# Altium schematic sheet 37.SchDoc (part 2 of 2)
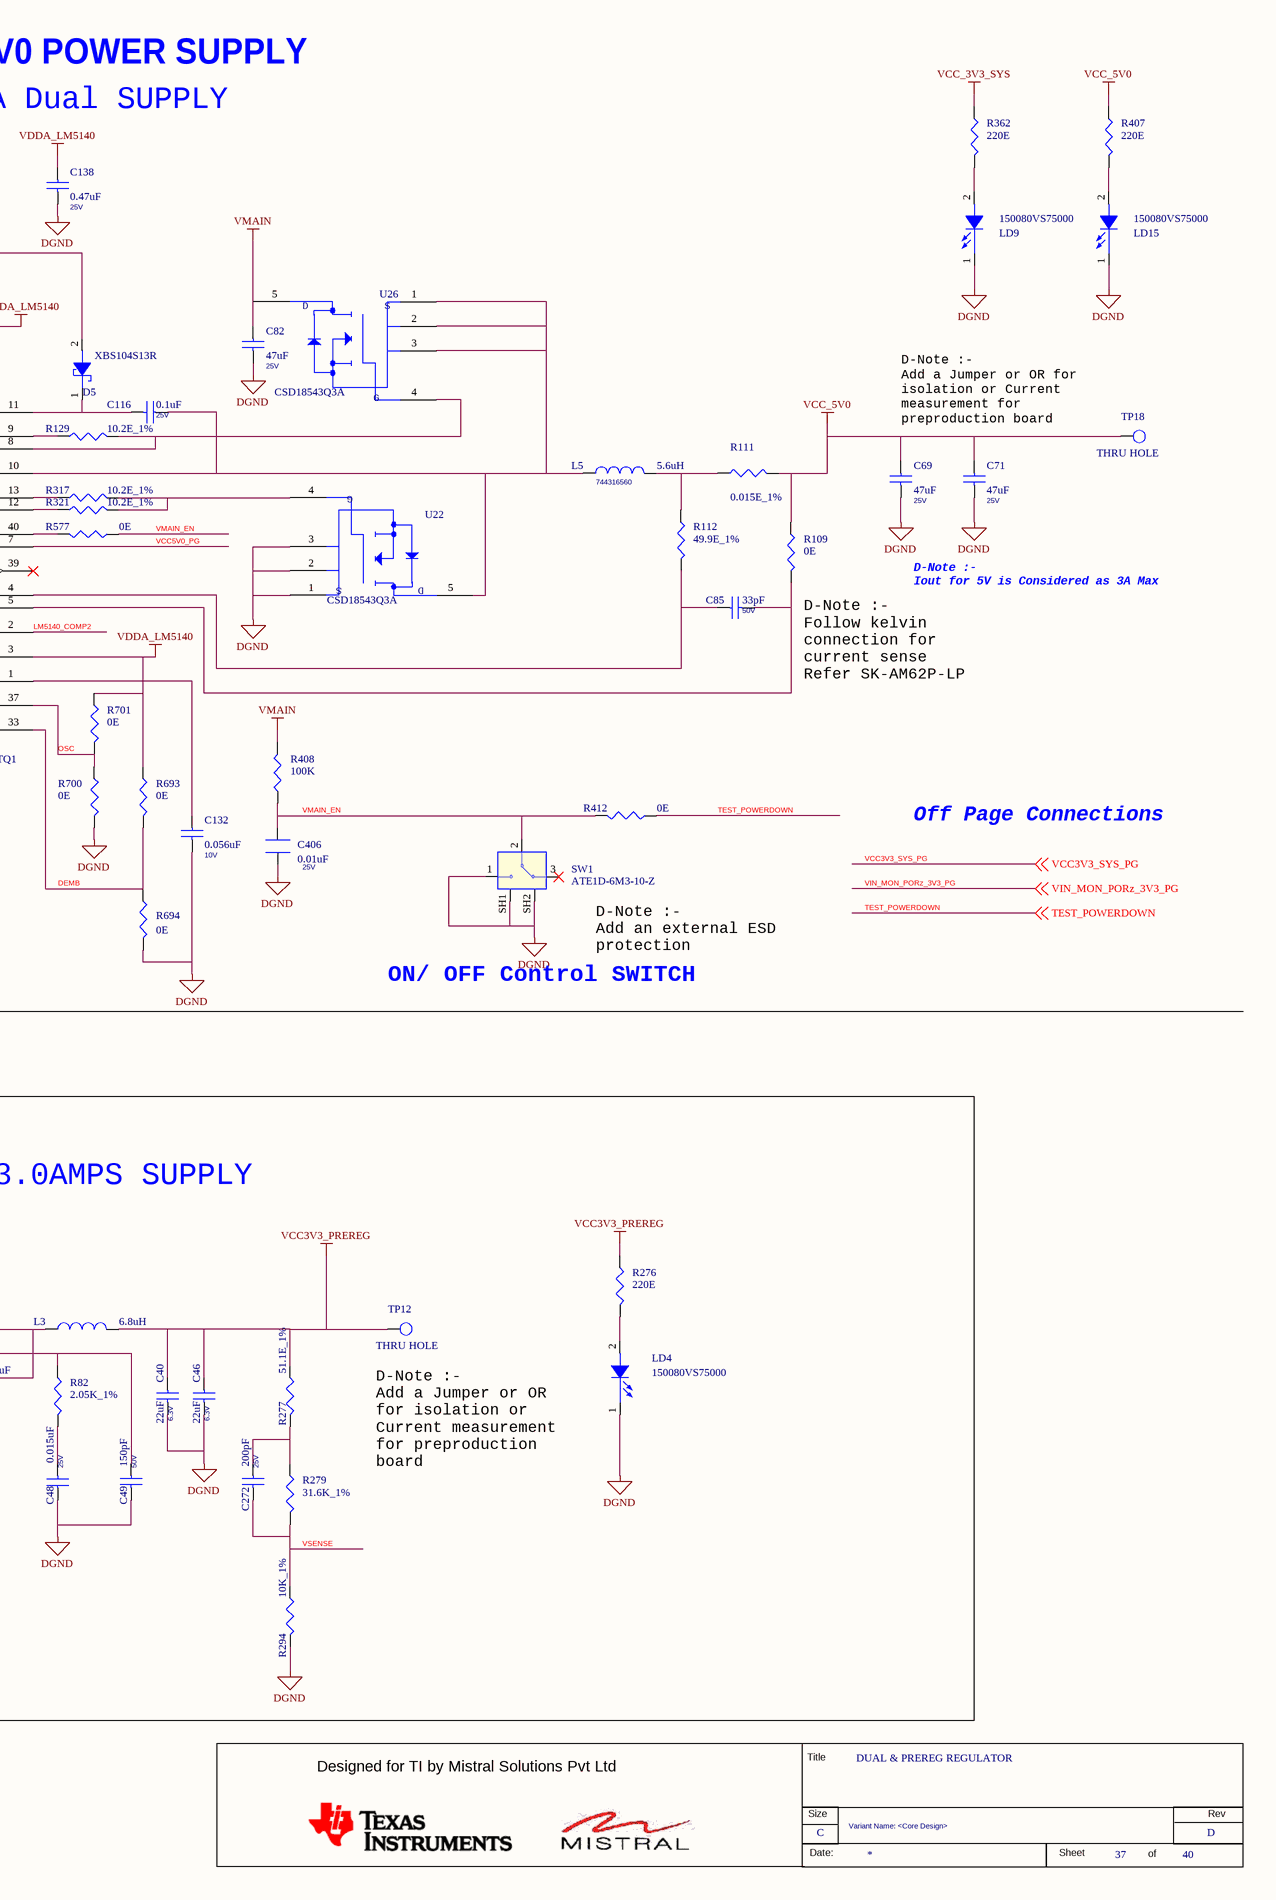
[diagram p2: 37.SchDoc, right]

## Library data of the parts
* = MISTRAL_TITLEBLK_CSIZE: Issue: 1.0; Page Create Date: March  8, 1995; Page Modify Date: *
C40 = CAP_Dup3: CAP CERAMIC 22uF 6.3V 20% X5R 0603; Mistral Part No: 120015090007-R; Mfr_name: MURATA; Mfr_part_number: GRM188R60J226MEA0; Part_type: CAPACITORS\CERAMIC; Project: OCTBTS_3000; Wattage: NA; Customs_HS_Code: 85322990; Custom_Duty: 15%; PCB Footprint: CAP0603_1; Footprint Path: Y:\MIS_DATABASE\Library\ALTIUM_TOOL\PCB_FOOTPRINTS\Altium_Footprint_Lib.PcbLib; Library Path: Y:\MIS_DATABASE\Library\ALTIUM_TOOL\SCHEMATICS_PARTS\MS_DISCRETE_Library.schlib; MECHANICAL 3D STEP FILE: CAP0603_1; Footprint Ref: CAP0603_1; Library Ref: CAP; Tolerance: 20%; Package: 0603; Distributor_name: DIGIKEY; Distributor_part_number: 490-7611-2-ND; Height: 1.00MM; Weight: 6.3mg; Temperature: -55癈+85癈; Datasheet: Y:\MIS_DATABASE\DATASHEETS\CAPACITORS\MURATA-GXX-SER_NOV17.PDF; Crtd /date: JEBRAN/090915; Chkd/date: JEBRAN/090915
C46 = CAP_Dup3: CAP CERAMIC 22uF 6.3V 20% X5R 0603; Part_type: CAPACITORS\CERAMIC; Mfr_part_number: GRM188R60J226MEA0; Mfr_name: MURATA; Mistral Part No: 120015090007-R; Custom_Duty: 15%; Customs_HS_Code: 85322990; Wattage: NA; Project: OCTBTS_3000; PCB Footprint: CAP0603_1; Chkd/date: JEBRAN/090915; Crtd /date: JEBRAN/090915; Datasheet: Y:\MIS_DATABASE\DATASHEETS\CAPACITORS\MURATA-GXX-SER_NOV17.PDF; Temperature: -55癈+85癈; Weight: 6.3mg; Height: 1.00MM; Distributor_part_number: 490-7611-2-ND; Distributor_name: DIGIKEY; Package: 0603; Tolerance: 20%; Library Ref: CAP; Footprint Ref: CAP0603_1; MECHANICAL 3D STEP FILE: CAP0603_1; Library Path: Y:\MIS_DATABASE\Library\ALTIUM_TOOL\SCHEMATICS_PARTS\MS_DISCRETE_Library.schlib; Footprint Path: Y:\MIS_DATABASE\Library\ALTIUM_TOOL\PCB_FOOTPRINTS\Altium_Footprint_Lib.PcbLib
C48 = CAP_Dup3: CAP CERAMIC 0.015uF 25V 10% X7R 0402; Mistral Part No: 120020080005-R; Mfr_name: WURTH ELECTRONICS; Mfr_part_number: 885012205051; Part_type: CAPACITORS\CERAMIC; Project: AM64x_EVM_BRD; Wattage: NA; Customs_HS_Code: 85322990; Custom_Duty: 15%; PCB Footprint: CAP0402_0-75; Library Ref: CAP; Tolerance: 10%; Package: 0402; Distributor_name: DIGIKEY; Distributor_part_number: 732-7546-1-ND; Height: 0.55MM; Weight: 0.65mg; Temperature: -55癈+125癈; Datasheet: Y:\MIS_DATABASE\DATASHEETS\CAPACITORS\885012205051.PDF; Crtd /date: ALVY/170820; Chkd/date: MANIRAJA/170820; Footprint Ref: CAP0402_0-75; MECHANICAL 3D STEP FILE: CAP0402_0-75; Library Path: Y:\MIS_DATABASE\Library\ALTIUM_TOOL\SCHEMATICS_PARTS\MS_DISCRETE_Library.schlib; Footprint Path: Y:\MIS_DATABASE\Library\ALTIUM_TOOL\PCB_FOOTPRINTS\Altium_Footprint_Lib.PcbLib
C49 = CAP_Dup3: CAP CERAMIC 150pF 50V 10% X7R 0402; Mistral Part No: 120018010022-R; Mfr_name: WURTH ELECTRONICS; Mfr_part_number: 885012205056; Part_type: CAPACITORS\CERAMIC; Project: TI_MAXIE_CPB; Wattage: NA; Customs_HS_Code: 85322990; Custom_Duty: 15%; PCB Footprint: CAP0402_0-75; Library Ref: CAP; Tolerance: 10%; Package: 0402; Distributor_name: DIGIKEY; Distributor_part_number: 732-7551-1-ND; Height: 0.55MM; Weight: 0.65mg; Temperature: -55癈+125癈; Datasheet: Y:\MIS_DATABASE\DATASHEETS\CAPACITORS\885012205056.PDF; Crtd /date: MANIRAJA/240118; Chkd/date: MANIRAJA/240118; MECHANICAL 3D STEP FILE: CAP0402_0-75; Footprint Ref: CAP0402_0-75; Library Path: Y:\MIS_DATABASE\Library\ALTIUM_TOOL\SCHEMATICS_PARTS\MS_DISCRETE_Library.schlib; Footprint Path: Y:\MIS_DATABASE\Library\ALTIUM_TOOL\PCB_FOOTPRINTS\Altium_Footprint_Lib.PcbLib
C54 C65 C115 = CAP_Dup3: CAP CERAMIC 0.1uF 25V 20% X5R 0402; Alt_Mfr_part_number: CC0402KRX5R8BB104; Mistral Part No: 120020080003-R; Mfr_name: WURTH ELECTRONICS; Mfr_part_number: 885012105018; Part_type: CAPACITORS\CERAMIC; Alt_Mfr_name: YAGEO AMERICA; Project: AM64x_EVM_BRD; Wattage: NA; Customs_HS_Code: 85322990; Custom_Duty: 15%; PCB Footprint: CAP0402_0-75; Tolerance: 20%; Package: 0402; Distributor_name: DIGIKEY; Distributor_part_number: 732-7495-1-ND; Height: 0.55MM; Weight: 0.65mg; Temperature: -55癈+85癈; Datasheet: Y:\MIS_DATABASE\DATASHEETS\CAPACITORS\885012105018.PDF; Crtd /date: ALVY/170820; Chkd/date: MANIRAJA/170820; MECHANICAL 3D STEP FILE: CAP0402_0-75; Library Ref: CAP; Footprint Ref: CAP0402_0-75; Library Path: Y:\MIS_DATABASE\Library\ALTIUM_TOOL\SCHEMATICS_PARTS\MS_DISCRETE_Library.schlib; Footprint Path: Y:\MIS_DATABASE\Library\ALTIUM_TOOL\PCB_FOOTPRINTS\Altium_Footprint_Lib.PcbLib
C66 = CAP_Dup3: CAP CERAMIC 10uF 35V 20% X5R 0603; Part_type: CAPACITORS\CERAMIC; Mfr_part_number: GRM188R6YA106MA73D; Mfr_name: MURATA; Mistral Part No: 120019050016-R; Custom_Duty: 15%; Customs_HS_Code: 85322990; Wattage: NA; Project: BRUKER_SD820_COMMONDO; PCB Footprint: CAP0603_1; Footprint Path: Y:\MIS_DATABASE\Library\ALTIUM_TOOL\PCB_FOOTPRINTS\Altium_Footprint_Lib.PcbLib; Library Path: Y:\MIS_DATABASE\Library\ALTIUM_TOOL\SCHEMATICS_PARTS\MS_DISCRETE_Library.schlib; Footprint Ref: CAP0603_1; Library Ref: CAP; MECHANICAL 3D STEP FILE: CAP0603_1; Chkd/date: MANIRAJA/170519; Crtd /date: ALVY/160519; Datasheet: Y:\MIS_DATABASE\DATASHEETS\CAPACITORS\GRM188R6YA106MA73.PDF; Temperature: -55癈+85癈; Weight: 9mg; Height: 1.00MM; Distributor_part_number: 490-13248-1-ND; Distributor_name: DIGIKEY; Package: 0603; Tolerance: 20%
C69 C81 C82 = CAP: CAP CERAMIC 47uF 25V 20% X5R 1206; Mistral Part No: 120013050002-R; Mfr_name: MURATA; Mfr_part_number: GRM31CR61E476ME44L; Part_type: CAPACITORS\CERAMIC; Project: TI_MAXIE_CPB; Wattage: NA; Customs_HS_Code: 85322990; Custom_Duty: 15%; PCB Footprint: CAP1206_2; Footprint Ref: CAP1206_2; Tolerance: 20%; Package: 1206; Distributor_name: DIGIKEY; Distributor_part_number: 490-16268-1-ND; Library Ref: CAP; Height: 1.80MM; Weight: 40mg; Temperature: -55癈+85癈; Datasheet: Y:\MIS_DATABASE\DATASHEETS\CAPACITORS\MURATA-GXX-SER_NOV17.PDF; Crtd /date: MANIRAJA/230118; Chkd/date: MANIRAJA/230118; MECHANICAL 3D STEP FILE: CAP1206_2; Library Path: Y:\MIS_DATABASE\Library\ALTIUM_TOOL\SCHEMATICS_PARTS\MS_DISCRETE_Library.schlib; Footprint Path: Y:\MIS_DATABASE\Library\ALTIUM_TOOL\PCB_FOOTPRINTS\Altium_Footprint_Lib.PcbLib
C70 = CAP_POL: CAP POLYMER 470uF 10V 20% SMD; Mistral Part No: 120020080001-R; Mfr_name: WURTH ELECTRONICS; Mfr_part_number: 875115252003; Part_type: CAPACITORS\POLYPROPYLENE; Project: AM64x_EVM_BRD; Wattage: NA; Customs_HS_Code: 85322990; Custom_Duty: 15%; Footprint Ref: CAPAE_875115252003_330X330_SMD_8-7; Tolerance: 20%; Voltage: 10V; Package: SMD; Distributor_name: DIGIKEY; Distributor_part_number: 732-6451-1-ND; Library Ref: CAP_POL; Height: 8.70MM; Weight: 640.2mg; Temperature: -55癈+105癈; Datasheet: Y:\MIS_DATABASE\DATASHEETS\CAPACITORS\875115252003.PDF; Crtd /date: ALVY/140820; Chkd/date: MANIRAJA/140820; MECHANICAL 3D STEP FILE: CAPAE_875115252003_330X330_SMD_8-7; Library Path: Y:\MIS_DATABASE\Library\ALTIUM_TOOL\SCHEMATICS_PARTS\MS_DISCRETE_Library.schlib; Footprint Path: Y:\MIS_DATABASE\Library\ALTIUM_TOOL\PCB_FOOTPRINTS\Altium_Footprint_Lib.PcbLib; PCB Footprint: CAPAE_875115252003_330X330_SMD_8-7
C71 = CAP_Dup3: CAP CERAMIC 47uF 25V 20% X5R 1206; Part_type: CAPACITORS\CERAMIC; Mfr_part_number: GRM31CR61E476ME44L; Mfr_name: MURATA; Mistral Part No: 120013050002-R; Custom_Duty: 15%; Customs_HS_Code: 85322990; Wattage: NA; Project: TI_MAXIE_CPB; PCB Footprint: CAP1206_2; Footprint Path: Y:\MIS_DATABASE\Library\ALTIUM_TOOL\PCB_FOOTPRINTS\Altium_Footprint_Lib.PcbLib; Library Path: Y:\MIS_DATABASE\Library\ALTIUM_TOOL\SCHEMATICS_PARTS\MS_DISCRETE_Library.schlib; Footprint Ref: CAP1206_2; Library Ref: CAP; MECHANICAL 3D STEP FILE: CAP1206_2; Chkd/date: MANIRAJA/230118; Crtd /date: MANIRAJA/230118; Datasheet: Y:\MIS_DATABASE\DATASHEETS\CAPACITORS\MURATA-GXX-SER_NOV17.PDF; Temperature: -55癈+85癈; Weight: 40mg; Height: 1.80MM; Distributor_part_number: 490-16268-1-ND; Distributor_name: DIGIKEY; Package: 1206; Tolerance: 20%
C84 = CAP_Dup3: CAP CERAMIC 22uF 25V 20% X6S 1206; Part_type: CAPACITORS\CERAMIC; Mfr_part_number: GRM31CC81E226ME11K; Mfr_name: MURATA; Mistral Part No: 120022050004-R; Custom_Duty: 15%; Customs_HS_Code: 85322990; Wattage: NA; Project: TI_AM62x_SKEVM_BRD; PCB Footprint: CAP1206_2; Library Ref: CAP; MECHANICAL 3D STEP FILE: CAP1206_2; Chkd/date: ALVY/160522; Crtd /date: ALVY/160522; Datasheet: Y:\MIS_DATABASE\DATASHEETS\CAPACITORS\GRM31CC81E226ME11.PDF; Temperature: -55癈+105癈; Weight: 27mg; Height: 1.90MM; Distributor_part_number: 81-GRM31CC81E226ME1K; Distributor_name: MOUSER; Package: 1206; Tolerance: 20%; Footprint Ref: CAP1206_2; Library Path: Y:\MIS_DATABASE\Library\ALTIUM_TOOL\SCHEMATICS_PARTS\MS_DISCRETE_Library.schlib; Footprint Path: Y:\MIS_DATABASE\Library\ALTIUM_TOOL\PCB_FOOTPRINTS\Altium_Footprint_Lib.PcbLib
C85 = CAP: CAP CERAMIC 33pF 50V 5% C0G(NP0) 0402; Part_type: CAPACITORS\CERAMIC; Mfr_part_number: 885012005058; Mfr_name: WURTH ELECTRONICS; Mistral Part No: 120009030395-R; Custom_Duty: 15%; Customs_HS_Code: 85322990; Wattage: NA; Project: AM64x_EVM_BRD; PCB Footprint: CAP0402_0-75; Footprint Path: Y:\MIS_DATABASE\Library\ALTIUM_TOOL\PCB_FOOTPRINTS\Altium_Footprint_Lib.PcbLib; Library Path: Y:\MIS_DATABASE\Library\ALTIUM_TOOL\SCHEMATICS_PARTS\MS_DISCRETE_Library.schlib; MECHANICAL 3D STEP FILE: CAP0402_0-75; Chkd/date: MANIRAJA/170820; Crtd /date: ALVY/170820; Datasheet: Y:\MIS_DATABASE\DATASHEETS\CAPACITORS\885012005058.PDF; Temperature: -55癈+125癈; Weight: 0.65mg; Height: 0.55MM; Library Ref: CAP; Distributor_part_number: 732-7472-1-ND; Distributor_name: DIGIKEY; Package: 0402; Tolerance: 5%; Footprint Ref: CAP0402_0-75
C94 C135 = CAP: CAP CERAMIC 33pF 50V 5% C0G(NP0) 0402; Mistral Part No: 120009030395-R; Mfr_name: WURTH ELECTRONICS; Mfr_part_number: 885012005058; Part_type: CAPACITORS\CERAMIC; Project: AM64x_EVM_BRD; Wattage: NA; Customs_HS_Code: 85322990; Custom_Duty: 15%; Footprint Ref: CAP0402_0-75; Tolerance: 5%; Package: 0402; Distributor_name: DIGIKEY; Distributor_part_number: 732-7472-1-ND; Library Ref: CAP; Height: 0.55MM; Weight: 0.65mg; Temperature: -55癈+125癈; Datasheet: Y:\MIS_DATABASE\DATASHEETS\CAPACITORS\885012005058.PDF; Crtd /date: ALVY/170820; Chkd/date: MANIRAJA/170820; MECHANICAL 3D STEP FILE: CAP0402_0-75; Library Path: Y:\MIS_DATABASE\Library\ALTIUM_TOOL\SCHEMATICS_PARTS\MS_DISCRETE_Library.schlib; Footprint Path: Y:\MIS_DATABASE\Library\ALTIUM_TOOL\PCB_FOOTPRINTS\Altium_Footprint_Lib.PcbLib; PCB Footprint: CAP0402_0-75
C107 = CAP: CAP CERAMIC 2.2uF 35V 10% X5R 0603; Mistral Part No: 120017010016-R; Mfr_name: MURATA; Mfr_part_number: GRM188R6YA225KA12D; Part_type: CAPACITORS\CERAMIC; Project: SD820_NANO_SOM; Wattage: NA; Customs_HS_Code: 85322990; Custom_Duty: 15%; PCB Footprint: CAP0603_1; Footprint Ref: CAP0603_1; Tolerance: 10%; Package: 0603; Distributor_name: DIGIKEY; Distributor_part_number: 490-7204-1-ND; Library Ref: CAP; Height: 0.90MM; Weight: 6.3mg; Temperature: -55癈+85癈; Datasheet: Y:\MIS_DATABASE\DATASHEETS\CAPACITORS\MURATA-GXX-SER_NOV17.PDF; Crtd /date: MANIRAJA/270117; Chkd/date: VASANTHA/270117; MECHANICAL 3D STEP FILE: CAP0603_1; Library Path: Y:\MIS_DATABASE\Library\ALTIUM_TOOL\SCHEMATICS_PARTS\MS_DISCRETE_Library.schlib; Footprint Path: Y:\MIS_DATABASE\Library\ALTIUM_TOOL\PCB_FOOTPRINTS\Altium_Footprint_Lib.PcbLib
C108 C539 = CAP: CAP CERAMIC 2.2uF 35V 10% X5R 0603; Part_type: CAPACITORS\CERAMIC; Mfr_part_number: GRM188R6YA225KA12D; Mfr_name: MURATA; Mistral Part No: 120017010016-R; Custom_Duty: 15%; Customs_HS_Code: 85322990; Wattage: NA; Project: SD820_NANO_SOM; PCB Footprint: CAP0603_1; Footprint Path: Y:\MIS_DATABASE\Library\ALTIUM_TOOL\PCB_FOOTPRINTS\Altium_Footprint_Lib.PcbLib; Library Path: Y:\MIS_DATABASE\Library\ALTIUM_TOOL\SCHEMATICS_PARTS\MS_DISCRETE_Library.schlib; MECHANICAL 3D STEP FILE: CAP0603_1; Chkd/date: VASANTHA/270117; Crtd /date: MANIRAJA/270117; Datasheet: Y:\MIS_DATABASE\DATASHEETS\CAPACITORS\MURATA-GXX-SER_NOV17.PDF; Temperature: -55癈+85癈; Weight: 6.3mg; Height: 0.90MM; Library Ref: CAP; Distributor_part_number: 490-7204-1-ND; Distributor_name: DIGIKEY; Package: 0603; Tolerance: 10%; Footprint Ref: CAP0603_1
C116 C494 = CAP_Dup3: CAP CERAMIC 0.1uF 25V 20% X5R 0402; Alt_Mfr_name: YAGEO AMERICA; Part_type: CAPACITORS\CERAMIC; Mfr_part_number: 885012105018; Mfr_name: WURTH ELECTRONICS; Mistral Part No: 120020080003-R; Alt_Mfr_part_number: CC0402KRX5R8BB104; Custom_Duty: 15%; Customs_HS_Code: 85322990; Wattage: NA; Project: AM64x_EVM_BRD; PCB Footprint: CAP0402_0-75; Footprint Path: Y:\MIS_DATABASE\Library\ALTIUM_TOOL\PCB_FOOTPRINTS\Altium_Footprint_Lib.PcbLib; Library Path: Y:\MIS_DATABASE\Library\ALTIUM_TOOL\SCHEMATICS_PARTS\MS_DISCRETE_Library.schlib; Footprint Ref: CAP0402_0-75; Library Ref: CAP; MECHANICAL 3D STEP FILE: CAP0402_0-75; Chkd/date: MANIRAJA/170820; Crtd /date: ALVY/170820; Datasheet: Y:\MIS_DATABASE\DATASHEETS\CAPACITORS\885012105018.PDF; Temperature: -55癈+85癈; Weight: 0.65mg; Height: 0.55MM; Distributor_part_number: 732-7495-1-ND; Distributor_name: DIGIKEY; Package: 0402; Tolerance: 20%
C118 C136 = CAP_Dup2: CAP CERAMIC 0.01uF 25V 10% X7R 0402; Part_type: CAPACITORS\CERAMIC; Mfr_part_number: 885012205050; Mfr_name: WURTH ELECTRONICS; Mistral Part No: 120011090040-R; PCB Footprint: CAP0402_0-75; Wattage: NA; Custom_Duty: 15%; Customs_HS_Code: 85322990; Project: AM64x_EVM_BRD; Footprint Path: Y:\MIS_DATABASE\Library\ALTIUM_TOOL\PCB_FOOTPRINTS\Altium_Footprint_Lib.PcbLib; Library Path: Y:\MIS_DATABASE\Library\ALTIUM_TOOL\SCHEMATICS_PARTS\MS_DISCRETE_Library.schlib; Footprint Ref: CAP0402_0-75; MECHANICAL 3D STEP FILE: CAP0402_0-75; Temperature: -55癈+125癈; Weight: 0.65mg; Chkd/date: MANIRAJA/170820; Crtd /date: ALVY/170820; Datasheet: Y:\MIS_DATABASE\DATASHEETS\CAPACITORS\885012205050.PDF; Height: 0.55MM; Distributor_part_number: 732-7545-1-ND; Distributor_name: DIGIKEY; Package: 0402; Tolerance: 10%; Library Ref: CAP
C123 = CAP: CAP CERAMIC 47uF 25V 20% X5R 1206; Part_type: CAPACITORS\CERAMIC; Mfr_part_number: GRM31CR61E476ME44L; Mfr_name: MURATA; Mistral Part No: 120013050002-R; Custom_Duty: 15%; Customs_HS_Code: 85322990; Wattage: NA; Project: TI_MAXIE_CPB; PCB Footprint: CAP1206_2; Footprint Path: Y:\MIS_DATABASE\Library\ALTIUM_TOOL\PCB_FOOTPRINTS\Altium_Footprint_Lib.PcbLib; Library Path: Y:\MIS_DATABASE\Library\ALTIUM_TOOL\SCHEMATICS_PARTS\MS_DISCRETE_Library.schlib; MECHANICAL 3D STEP FILE: CAP1206_2; Chkd/date: MANIRAJA/230118; Crtd /date: MANIRAJA/230118; Datasheet: Y:\MIS_DATABASE\DATASHEETS\CAPACITORS\MURATA-GXX-SER_NOV17.PDF; Temperature: -55癈+85癈; Weight: 40mg; Height: 1.80MM; Library Ref: CAP; Distributor_part_number: 490-16268-1-ND; Distributor_name: DIGIKEY; Package: 1206; Tolerance: 20%; Footprint Ref: CAP1206_2
C125 = CAP_Dup3: CAP CERAMIC 3900pF 25V 10% X7R 0402; Mistral Part No: 120015120019-R; Mfr_name: YAGEO AMERICA; Mfr_part_number: CC0402KRX7R8BB392; Part_type: CAPACITORS\CERAMIC; Project: DLRL_NBSDR; Wattage: NA; Customs_HS_Code: 85322990; Custom_Duty: 15%; PCB Footprint: CAP0402_0-75; Footprint Ref: CAP0402_0-75; Tolerance: 10%; Package: 0402; Distributor_name: DIGIKEY; Distributor_part_number: 311-1038-1-ND; Library Ref: CAP; Height: 0.55MM; Weight: 0.65mg; Temperature: -55癈+125癈; Datasheet: Y:\MIS_DATABASE\DATASHEETS\CAPACITORS\YACC-X7R.PDF; Crtd /date: VASANTHA/211215; Chkd/date: VASANTHA/211215; MECHANICAL 3D STEP FILE: CAP0402_0-75; Library Path: Y:\MIS_DATABASE\Library\ALTIUM_TOOL\SCHEMATICS_PARTS\MS_DISCRETE_Library.schlib; Footprint Path: Y:\MIS_DATABASE\Library\ALTIUM_TOOL\PCB_FOOTPRINTS\Altium_Footprint_Lib.PcbLib
C130 = CAP_Dup2: CAP CERAMIC 4.7pF 50V 0.25pF HI-Q C0G(NP0) 0402; Mistral Part No: 120013040025-R; Mfr_name: MURATA; Mfr_part_number: GJM1555C1H4R7CB01D; Part_type: CAPACITORS\CERAMIC; PCB Footprint: CAP0402_0-75; Project: DTRM; Tolerance: 0.25pF%; Customs_HS_Code: 85322990; Custom_Duty: 15%; Wattage: NA; Library Ref: CAP; Package: 0402; Distributor_name: DIGIKEY; Distributor_part_number: 490-3100-1-ND; Height: 0.55MM; Datasheet: Y:\MIS_DATABASE\DATASHEETS\CAPACITORS\MURATA-GXX-SER_NOV17.PDF; Crtd /date: USMAN/290413; Chkd/date: VASANTHA/220814; Weight: 6mg; Temperature: -55癈+125癈; MECHANICAL 3D STEP FILE: CAP0402_0-75; Footprint Ref: CAP0402_0-75; Library Path: Y:\MIS_DATABASE\Library\ALTIUM_TOOL\SCHEMATICS_PARTS\MS_DISCRETE_Library.schlib; Footprint Path: Y:\MIS_DATABASE\Library\ALTIUM_TOOL\PCB_FOOTPRINTS\Altium_Footprint_Lib.PcbLib
C131 C132 = CAP_Dup3: CAP CERAMIC 0.056uF 10V 10% X7R 0402; Part_type: CAPACITORS\CERAMIC; Mfr_part_number: C0402C563K8RACTU; Mfr_name: KEMET; Mistral Part No: 120011110014-R; Custom_Duty: 15%; Customs_HS_Code: 85322990; Wattage: NA; Project: AVCDP1; PCB Footprint: CAP0402_0-75; MECHANICAL 3D STEP FILE: CAP0402_0-75; Chkd/date: USMAN/161111; Crtd /date: CHAITHANYA/151111; Datasheet: Y:\MIS_DATABASE\DATASHEETS\CAPACITORS\KEMET-C-X7R.PDF; Temperature: -55癈+125癈; Weight: 0.65mg; Height: 0.55MM; Distributor_part_number: 399-4902-1-ND; Distributor_name: DIGIKEY; Package: 0402; Tolerance: 10%; Library Ref: CAP; Footprint Ref: CAP0402_0-75; Library Path: Y:\MIS_DATABASE\Library\ALTIUM_TOOL\SCHEMATICS_PARTS\MS_DISCRETE_Library.schlib; Footprint Path: Y:\MIS_DATABASE\Library\ALTIUM_TOOL\PCB_FOOTPRINTS\Altium_Footprint_Lib.PcbLib
C137 = CAP_Dup3: CAP CERAMIC 1uF 10V 20% X5R 0402; Part_type: CAPACITORS\CERAMIC; Mfr_part_number: 885012105012; Mfr_name: WURTH ELECTRONICS; Mistral Part No: 120020080009-R; Custom_Duty: 15%; Customs_HS_Code: 85322990; Wattage: NA; Project: AM64x_EVM_BRD; PCB Footprint: CAP0402_0-75; Footprint Ref: CAP0402_0-75; Library Ref: CAP; Footprint Path: Y:\MIS_DATABASE\Library\ALTIUM_TOOL\PCB_FOOTPRINTS\Altium_Footprint_Lib.PcbLib; Library Path: Y:\MIS_DATABASE\Library\ALTIUM_TOOL\SCHEMATICS_PARTS\MS_DISCRETE_Library.schlib; MECHANICAL 3D STEP FILE: CAP0402_0-75; Chkd/date: MANIRAJA/210820; Crtd /date: ALVY/190820; Datasheet: Y:\MIS_DATABASE\DATASHEETS\CAPACITORS\885012105012.PDF; Temperature: -55癈+85癈; Weight: 0.65mg; Height: 0.55MM; Distributor_part_number: 732-7489-1-ND; Distributor_name: DIGIKEY; Package: 0402; Tolerance: 20%
C138 = CAP: CAP CERAMIC 0.47uF 25V 10% X7R 0603; Mistral Part No: 120009030111-R; Mfr_name: WURTH ELECTRONICS; Mfr_part_number: 885012206075; Part_type: CAPACITORS\CERAMIC; Project: AM64x_EVM_BRD; Wattage: NA; Customs_HS_Code: 85322990; Custom_Duty: 15%; PCB Footprint: CAP0603_1; Footprint Ref: CAP0603_1; Tolerance: 10%; Package: 0603; Distributor_name: DIGIKEY; Distributor_part_number: 732-7993-1-ND; Library Ref: CAP; Height: 0.95MM; Weight: 35mg; Temperature: -55癈+125癈; Datasheet: Y:\MIS_DATABASE\DATASHEETS\CAPACITORS\885012206075.PDF; Crtd /date: ALVY/170820; Chkd/date: MANIRAJA/170820; MECHANICAL 3D STEP FILE: CAP0603_1; Library Path: Y:\MIS_DATABASE\Library\ALTIUM_TOOL\SCHEMATICS_PARTS\MS_DISCRETE_Library.schlib; Footprint Path: Y:\MIS_DATABASE\Library\ALTIUM_TOOL\PCB_FOOTPRINTS\Altium_Footprint_Lib.PcbLib
C272 = CAP_Dup3: CAP CERAMIC 200pF 25V 5% C0G(NP0) 0402; Part_type: CAPACITORS\CERAMIC; Mfr_part_number: GRM1555C1E201JA01D; Mfr_name: MURATA; Mistral Part No: 120022050005-R; Custom_Duty: 15%; Customs_HS_Code: 85322990; Wattage: NA; Project: TI_AM62x_SKEVM_BRD; PCB Footprint: CAP0402_0-75; Library Ref: CAP; MECHANICAL 3D STEP FILE: CAP0402_0-75; Chkd/date: ALVY/160522; Crtd /date: ALVY/160522; Datasheet: Y:\MIS_DATABASE\DATASHEETS\CAPACITORS\GRM1555C1E201JA01.PDF; Temperature: -55癈+125癈; Weight: 1.5mg; Height: 0.55MM; Distributor_part_number: GRM1555C1E201JA01D-ND; Distributor_name: DIGIKEY; Package: 0402; Tolerance: 5%; Footprint Ref: CAP0402_0-75; Library Path: Y:\MIS_DATABASE\Library\ALTIUM_TOOL\SCHEMATICS_PARTS\MS_DISCRETE_Library.schlib; Footprint Path: Y:\MIS_DATABASE\Library\ALTIUM_TOOL\PCB_FOOTPRINTS\Altium_Footprint_Lib.PcbLib
C406 = CAP_Dup2: CAP CERAMIC 0.01uF 25V 10% X7R 0402; Mistral Part No: 120011090040-R; Mfr_name: WURTH ELECTRONICS; Mfr_part_number: 885012205050; Part_type: CAPACITORS\CERAMIC; PCB Footprint: CAP0402_0-75; Project: AM64x_EVM_BRD; Customs_HS_Code: 85322990; Custom_Duty: 15%; Wattage: NA; Library Ref: CAP; Tolerance: 10%; Package: 0402; Distributor_name: DIGIKEY; Distributor_part_number: 732-7545-1-ND; Height: 0.55MM; Datasheet: Y:\MIS_DATABASE\DATASHEETS\CAPACITORS\885012205050.PDF; Crtd /date: ALVY/170820; Chkd/date: MANIRAJA/170820; Weight: 0.65mg; Temperature: -55癈+125癈; MECHANICAL 3D STEP FILE: CAP0402_0-75; Footprint Ref: CAP0402_0-75; Library Path: Y:\MIS_DATABASE\Library\ALTIUM_TOOL\SCHEMATICS_PARTS\MS_DISCRETE_Library.schlib; Footprint Path: Y:\MIS_DATABASE\Library\ALTIUM_TOOL\PCB_FOOTPRINTS\Altium_Footprint_Lib.PcbLib
D4 D5 = DIODE_SCHOTTKY: DIODE SCHOTTKY 40V 1A SOD323A; Part_type: DIODE\SCHOTTKY; Mfr_part_number: XBS104S13R-G; Mfr_name: TOREX; Mistral Part No: 130018020038-R; Custom_Duty: 24%; Customs_HS_Code: 85437099; Wattage: NA; Project: TI_MAXIE_CPB; MECHANICAL 3D STEP FILE: DIO_SOD323_1; Chkd/date: MANIRAJA/150218; Crtd /date: ALVY/150218; Datasheet: Y:\MIS_DATABASE\DATASHEETS\DISCRETES\DIODES\XBS104S13R-G.PDF; Temperature: NA; Weight: NA; Height: 1.00MM; Distributor_part_number: 893-1188-1-ND; Distributor_name: DIGIKEY; Package: SOD323; Voltage: 40V; Tolerance: NA; Library Path: Y:\MIS_DATABASE\Library\ALTIUM_TOOL\SCHEMATICS_PARTS\MS_DISCRETE_Library.schlib; Footprint Path: Y:\MIS_DATABASE\Library\ALTIUM_TOOL\PCB_FOOTPRINTS\Altium_Footprint_Lib.PcbLib; Library Ref: DIODE_SCHOTTKY; Footprint Ref: DIO_SOD323_1; PCB Footprint: DIO_SOD323_1
L3 = INDUCTOR_Dup1: IND POWER 6.8uH 6.5A 20% SMD; Mfr_part_number: 74439346068; Mfr_name: WURTH ELECTRONICS; Mistral Part No: 130017100019-R; Custom_Duty: 24%; Customs_HS_Code: 85437099; Wattage: NA; Project: TI_MAXIE_CPB; PCB Footprint: IND_74439346068_260X270_SMD_6-1; Library Ref: INDUCTOR; MECHANICAL 3D STEP FILE: IND_74439346068_260X270_SMD_6-1; Chkd/date: MANIRAJA/171017; Crtd /date: MANIRAJA/171017; Datasheet: Y:\MIS_DATABASE\DATASHEETS\DISCRETES\INDUCTORS\74439346068.PDF; Temperature: -40癈+125癈; Weight: NA; Height: 6.10MM; Distributor_part_number: 732-10705-1-ND; Distributor_name: DIGIKEY; Package: SMD; Voltage: NA; Tolerance: 20%; Part_type: INDUCTOR
L5 = INDUCTOR_Dup1: IND HI-CURRENT 5.6uH 4.5A 20% SMD; Mistral Part No: 130023110008-R; Mfr_name: WURTH ELEKTRONIK; Project: AM62x_SK_EVM; Tolerance: 0.2; Voltage: NA; Customs_HS_Code: 85437099; Custom_Duty: 24%; Part_type: INDUCTOR; Wattage: NA; Package: SMD; Distributor_name: DIGIKEY; Distributor_part_number: 732-6183-1-ND; Library Ref: INDUCTOR; Footprint Ref: IND_744316100_230X220_SMD_4-3; Height: 4.30MM; Weight: 570mg; Temperature: -40癈+150癈; Datasheet: Y:\MIS_DATABASE\DATASHEETS\DISCRETES\INDUCTORS\744316560.PDF; Crtd /date: PRADEEP/171123; Chkd/date: PRADEEP/171123; MECHANICAL 3D STEP FILE: IND_744316100_230X220_SMD_4-3; Library Path: Y:\MIS_DATABASE\Library\ALTIUM_TOOL\SCHEMATICS_PARTS\MS_DISCRETE_Library.schlib; Footprint Path: Y:\MIS_DATABASE\Library\ALTIUM_TOOL\PCB_FOOTPRINTS\Altium_Footprint_Lib.PcbLib; PCB Footprint: IND_744316100_230X220_SMD_4-3
L6 = INDUCTOR: IND POWER 1.5uH 8A 20% SMD; Mistral Part No: 130023060041-R; Mfr_name: WURTH ELEKTRONIK; Project: SDI_MODULE; Voltage: NA; Customs_HS_Code: 85437099; Custom_Duty: 0.24; Footprint Ref: IND_74437349012_270X270_SMD_5; Part_type: INDUCTOR; Tolerance: 20%; Wattage: NA; Package: SMD; Distributor_name: DIGIKEY; Distributor_part_number: 732-3351-1-ND; Library Ref: INDUCTOR; Height: 5.00MM; Weight: 1220mg; Temperature: -40癈+125癈; Datasheet: Y:\MIS_DATABASE\DATASHEETS\DISCRETES\INDUCTORS\74437349015.PDF; Crtd /date: PRADEEP/280623; Chkd/date: PRADEEP/280623; MECHANICAL 3D STEP FILE: IND_74437349012_270X270_SMD_5; Library Path: Y:\MIS_DATABASE\Library\ALTIUM_TOOL\SCHEMATICS_PARTS\MS_DISCRETE_Library.schlib; Footprint Path: Y:\MIS_DATABASE\Library\ALTIUM_TOOL\PCB_FOOTPRINTS\Altium_Footprint_Lib.PcbLib; PCB Footprint: IND_74437349012_270X270_SMD_5
LD4 LD9 LD15 = DIODE_LED: DIODE LED BRIGHT GREEN SMD; Part_type: OPTO\LED; Mfr_name: WURTH ELECTRONICS; Mistral Part No: 130020080012-R; Custom_Duty: 24%; Customs_HS_Code: 85439000; Wattage: NA; Project: AM64x_EVM_BRD; Footprint Path: Y:\MIS_DATABASE\Library\ALTIUM_TOOL\PCB_FOOTPRINTS\Altium_Footprint_Lib.PcbLib; Library Path: Y:\MIS_DATABASE\Library\ALTIUM_TOOL\SCHEMATICS_PARTS\MS_OPTO_Library.schlib; MECHANICAL 3D STEP FILE: LED_150080VS75000_80X50_SMD_0-8; Chkd/date: MANIRAJA/180820; Crtd /date: ALVY/180820; Datasheet: Y:\MIS_DATABASE\DATASHEETS\DISCRETES\LEDS\150080VS75000.PDF; Temperature: -40癈+85癈; Weight: 10mg; Height: 0.80MM; Library Ref: DIODE_LED; Distributor_part_number: 732-4986-1-ND; Distributor_name: DIGIKEY; Package: SMD; Voltage: NA; Tolerance: NA; Mfr_part_number: 150080VS75000; Footprint Ref: LED_150080VS75000_80X50_SMD_0-8; PCB Footprint: LED_150080VS75000_80X50_SMD_0-8
R82 = RESISTOR_Dup6: RES 2.05K 1/10W 1% 0402; Part_type: RESISTORS\FIXED; Mfr_part_number: ERJ-2RKF2051X; Mfr_name: PANASONIC-ECG; Mistral Part No: 110014110019-R; Custom_Duty: 15%; Customs_HS_Code: 85332119; Voltage: NA; Project: ZK BIOMETRIC; Library Ref: RESISTOR; Chkd/date: NAVEED/261214; Crtd /date: JEBRAN/271114; Datasheet: Y:\MIS_DATABASE\DATASHEETS\RESISTORS\PAN-ERJSER_NOV17.PDF; Temperature: -55癈+155癈; Weight: 0.8mg; Height: 0.40MM; Distributor_part_number: P2.05KLCT-ND; Distributor_name: DIGIKEY; Package: 0402; Wattage: 1/10W; Tolerance: 1%; Footprint Ref: RES0402_0-5; PCB Footprint: RES0402_0-5; MECHANICAL 3D STEP FILE: RES0402_0-5; Library Path: Y:\MIS_DATABASE\Library\ALTIUM_TOOL\SCHEMATICS_PARTS\MS_DISCRETE_Library.schlib; Footprint Path: Y:\MIS_DATABASE\Library\ALTIUM_TOOL\PCB_FOOTPRINTS\Altium_Footprint_Lib.PcbLib
R109 R113 = RESISTOR_Dup1: RES 0E 1/16W JUMPER 0402; Mistral Part No: 110010080019-R; Mfr_name: VISHAY; Mfr_part_number: CRCW04020000Z0ED; Part_type: RESISTORS\FIXED; Project: PB_BUGBASE; Tolerance: NA; Customs_HS_Code: 85332119; Custom_Duty: 15%; Voltage: NA; Wattage: 1/16W; Package: 0402; Distributor_name: DIGIKEY; Distributor_part_number: 541-0.0JCT-ND; Height: 0.40MM; Weight: 0.65mg; Temperature: -55癈+155癈; Datasheet: Y:\MIS_DATABASE\DATASHEETS\RESISTORS\CRCW0603.PDF; Crtd /date: MUDDU/190810; Chkd/date: VASANTHA/201216; MECHANICAL 3D STEP FILE: RES0402_0-5; Library Ref: RESISTOR; Footprint Ref: RES0402_0-5; Library Path: Y:\MIS_DATABASE\Library\ALTIUM_TOOL\SCHEMATICS_PARTS\MS_DISCRETE_Library.schlib; Footprint Path: Y:\MIS_DATABASE\Library\ALTIUM_TOOL\PCB_FOOTPRINTS\Altium_Footprint_Lib.PcbLib; PCB Footprint: RES0402_0-5
R111 = RESISTOR_Dup1: RES 0.015E 1W 1% AUTO 1206 (HP); Mistral Part No: 110021040031-R; Mfr_name: VISHAY; Mfr_part_number: WSLP1206R0150FEA; Part_type: RESISTORS\FIXED; Project: SP_EP2_RX BRD; Voltage: NA; Customs_HS_Code: 85332119; Custom_Duty: 15%; Footprint Ref: RES1206_1; Tolerance: 1%; Wattage: 1W; Package: 1206; Distributor_name: DIGIKEY; Distributor_part_number: WSLP-.015CT-ND; Library Ref: RESISTOR; Height: 0.89MM; Weight: 16.2mg; Temperature: -65癈+170癈; Datasheet: Y:\MIS_DATABASE\DATASHEETS\RESISTORS\WSLP-SERIES.PDF; Crtd /date: ALVY/210421; Chkd/date: MANIRAJA/210421; MECHANICAL 3D STEP FILE: RES1206_1; Library Path: Y:\MIS_DATABASE\Library\ALTIUM_TOOL\SCHEMATICS_PARTS\MS_DISCRETE_Library.schlib; Footprint Path: Y:\MIS_DATABASE\Library\ALTIUM_TOOL\PCB_FOOTPRINTS\Altium_Footprint_Lib.PcbLib; PCB Footprint: RES1206_1
R112 R119 = RESISTOR: RES 49.9E 1/16W 1% 0402; Part_type: RESISTORS\FIXED; Mfr_part_number: CRCW040249R9FKEDC; Mfr_name: VISHAY; Mistral Part No: 110009030846-R; Custom_Duty: 15%; Customs_HS_Code: 85332119; Voltage: NA; Project: RFSU_RFTJ_CARD; Footprint Path: Y:\MIS_DATABASE\Library\ALTIUM_TOOL\PCB_FOOTPRINTS\Altium_Footprint_Lib.PcbLib; Library Path: Y:\MIS_DATABASE\Library\ALTIUM_TOOL\SCHEMATICS_PARTS\MS_DISCRETE_Library.schlib; MECHANICAL 3D STEP FILE: RES0402_0-5; Chkd/date: MANIRAJA/210519; Crtd /date: MANIRAJA/210519; Datasheet: Y:\MIS_DATABASE\DATASHEETS\RESISTORS\CRCW_C-SER.PDF; Temperature: -55癈+155癈; Weight: 0.65mg; Height: 0.35MM; Library Ref: RESISTOR; Distributor_part_number: 541-3967-1-ND; Distributor_name: DIGIKEY; Package: 0402; Wattage: 1/16W; Tolerance: 1%; Footprint Ref: RES0402_0-5; PCB Footprint: RES0402_0-5
R116 = RESISTOR_Dup6: RES 0.006E 1W 1% 1206; Mistral Part No: 110019050013-R; Mfr_name: ROHM; Mfr_part_number: PMR18EZPFU6L00; Part_type: RESISTORS\FIXED; Project: BRUKER_SD820_COMMONDO; Voltage: NA; Customs_HS_Code: 85332119; Custom_Duty: 15%; Footprint Ref: RES1206_0-75; Tolerance: 1%; Wattage: 1W; Package: 1206; Distributor_name: DIGIKEY; Distributor_part_number: RHM.006ALCT-ND; Library Ref: RESISTOR; Height: 0.59MM; Weight: 16.2mg; Temperature: -55癈+155癈; Datasheet: Y:\MIS_DATABASE\DATASHEETS\RESISTORS\PMR-SER_REVG.PDF; Crtd /date: ALVY/100519; Chkd/date: MANIRAJA/130519; MECHANICAL 3D STEP FILE: RES1206_0-75; Library Path: Y:\MIS_DATABASE\Library\ALTIUM_TOOL\SCHEMATICS_PARTS\MS_DISCRETE_Library.schlib; Footprint Path: Y:\MIS_DATABASE\Library\ALTIUM_TOOL\PCB_FOOTPRINTS\Altium_Footprint_Lib.PcbLib; PCB Footprint: RES1206_0-75
R129 R318 R321 = RESISTOR_Dup6: RES 10.2E 1/16W 1% 0402; Part_type: RESISTORS\FIXED; Mfr_part_number: CRCW040210R2FKED; Mfr_name: VISHAY; Mistral Part No: 110017080001-R; Custom_Duty: 15%; Customs_HS_Code: 85332119; Voltage: NA; Project: TI_SVB_DUT; MECHANICAL 3D STEP FILE: RES0402_0-5; Chkd/date: MANIRAJA/030817; Crtd /date: MANIRAJA/030817; Datasheet: Y:\MIS_DATABASE\DATASHEETS\RESISTORS\CRCW0603.PDF; Temperature: -55癈+155癈; Weight: 0.65mg; Height: 0.40MM; Distributor_part_number: 541-10.2LCT-ND; Distributor_name: DIGIKEY; Package: 0402; Wattage: 1/16W; Tolerance: 1%; Library Ref: RESISTOR; PCB Footprint: RES0402_0-5; Footprint Ref: RES0402_0-5; Library Path: Y:\MIS_DATABASE\Library\ALTIUM_TOOL\SCHEMATICS_PARTS\MS_DISCRETE_Library.schlib; Footprint Path: Y:\MIS_DATABASE\Library\ALTIUM_TOOL\PCB_FOOTPRINTS\Altium_Footprint_Lib.PcbLib
R130 R317 R319 = RESISTOR_Dup6: RES 10.2E 1/16W 1% 0402; Mistral Part No: 110017080001-R; Mfr_name: VISHAY; Mfr_part_number: CRCW040210R2FKED; Part_type: RESISTORS\FIXED; Project: TI_SVB_DUT; Voltage: NA; Customs_HS_Code: 85332119; Custom_Duty: 15%; PCB Footprint: RES0402_0-5; Footprint Path: Y:\MIS_DATABASE\Library\ALTIUM_TOOL\PCB_FOOTPRINTS\Altium_Footprint_Lib.PcbLib; Library Path: Y:\MIS_DATABASE\Library\ALTIUM_TOOL\SCHEMATICS_PARTS\MS_DISCRETE_Library.schlib; Footprint Ref: RES0402_0-5; Library Ref: RESISTOR; Tolerance: 1%; Wattage: 1/16W; Package: 0402; Distributor_name: DIGIKEY; Distributor_part_number: 541-10.2LCT-ND; Height: 0.40MM; Weight: 0.65mg; Temperature: -55癈+155癈; Datasheet: Y:\MIS_DATABASE\DATASHEETS\RESISTORS\CRCW0603.PDF; Crtd /date: MANIRAJA/030817; Chkd/date: MANIRAJA/030817; MECHANICAL 3D STEP FILE: RES0402_0-5
R131 = RESISTOR_Dup5: RES 10K 1/16W 1% 0402; Part_type: RESISTORS\FIXED; Mfr_part_number: RC0402FR-0710KL; Mfr_name: YAGEO AMERICA; Mistral Part No: 110015090015-R; Custom_Duty: 15%; Customs_HS_Code: 85332119; Project: VOCERA; Voltage: NA; PCB Footprint: RES0402_0-5; Footprint Path: Y:\MIS_DATABASE\Library\ALTIUM_TOOL\PCB_FOOTPRINTS\Altium_Footprint_Lib.PcbLib; Library Path: Y:\MIS_DATABASE\Library\ALTIUM_TOOL\SCHEMATICS_PARTS\MS_DISCRETE_Library.schlib; Footprint Ref: RES0402_0-5; Library Ref: RESISTOR; Chkd/date: VASANTHA/201216; Crtd /date: GEETHA/290506; Datasheet: Y:\MIS_DATABASE\DATASHEETS\RESISTORS\RCXXXXL-SER_MAR18.PDF; Height: 0.40MM; Distributor_part_number: 311-10.0KLRTR-ND; Distributor_name: DIGIKEY; Package: 0402; Wattage: 1/16W; Tolerance: 1%; Weight: 0.65mg; Temperature: -55癈+155癈; MECHANICAL 3D STEP FILE: RES0402_0-5
R134 R408 = RESISTOR_Dup6: RES 100K 1/16W 5% 0402; Part_type: RESISTORS\FIXED; Mfr_part_number: CRCW0402100KJNED; Mfr_name: VISHAY; Mistral Part No: 110011060002-R; Custom_Duty: 15%; Customs_HS_Code: 85332119; Voltage: NA; Project: AM4515_EVM_LCD; MECHANICAL 3D STEP FILE: RES0402_0-5; Chkd/date: VASANTHA/061216; Crtd /date: BAVISH/010611; Datasheet: Y:\MIS_DATABASE\DATASHEETS\RESISTORS\CRCW0603.PDF; Temperature: -55癈+155癈; Weight: 0.65mg; Height: 0.40MM; Distributor_part_number: 541-100KJCT-ND; Distributor_name: DIGIKEY; Package: 0402; Wattage: 1/16W; Tolerance: 5%; Library Ref: RESISTOR; PCB Footprint: RES0402_0-5; Footprint Ref: RES0402_0-5; Library Path: Y:\MIS_DATABASE\Library\ALTIUM_TOOL\SCHEMATICS_PARTS\MS_DISCRETE_Library.schlib; Footprint Path: Y:\MIS_DATABASE\Library\ALTIUM_TOOL\PCB_FOOTPRINTS\Altium_Footprint_Lib.PcbLib
R141 = RESISTOR_Dup6: RES 3.92K 1/16W 1% 0402; Mistral Part No: 110018010004-R; Mfr_name: VISHAY; Mfr_part_number: CRCW04023K92FKED; Part_type: RESISTORS\FIXED; Project: MS_DRDL_ITS2-SC; Voltage: NA; Customs_HS_Code: 85332119; Custom_Duty: 15%; Footprint Ref: RES0402_0-5; Tolerance: 1%; Wattage: 1/16W; Package: 0402; Distributor_name: DIGIKEY; Distributor_part_number: 541-3.92KLCT-ND; Library Ref: RESISTOR; Height: 0.40MM; Weight: 0.65mg; Temperature: -55癈+155癈; Datasheet: Y:\MIS_DATABASE\DATASHEETS\RESISTORS\CRCW0603.PDF; Crtd /date: ALVY/020118; Chkd/date: MANIRAJA/020118; MECHANICAL 3D STEP FILE: RES0402_0-5; Library Path: Y:\MIS_DATABASE\Library\ALTIUM_TOOL\SCHEMATICS_PARTS\MS_DISCRETE_Library.schlib; Footprint Path: Y:\MIS_DATABASE\Library\ALTIUM_TOOL\PCB_FOOTPRINTS\Altium_Footprint_Lib.PcbLib; PCB Footprint: RES0402_0-5
R142 = RESISTOR_Dup6: RES 2.2K 1/16W 5% 0402; Part_type: RESISTORS\FIXED; Mfr_part_number: RC0402JR-072K2L; Mfr_name: YAGEO AMERICA; Mistral Part No: 110010120018-R; Custom_Duty: 15%; Customs_HS_Code: 85332119; Voltage: NA; Project: TE4; PCB Footprint: RES0402_0-5; Library Ref: RESISTOR; Footprint Path: Y:\MIS_DATABASE\Library\ALTIUM_TOOL\PCB_FOOTPRINTS\Altium_Footprint_Lib.PcbLib; MECHANICAL 3D STEP FILE: RES0402_0-5; Chkd/date: VASANTHA/061216; Crtd /date: BAVISH/021210; Datasheet: Y:\MIS_DATABASE\DATASHEETS\RESISTORS\RCXXXXL-SER_MAR18.PDF; Temperature: -55癈+155癈; Weight: 0.65mg; Height: 0.40MM; Distributor_part_number: 311-2.2KJRCT-ND; Distributor_name: DIGIKEY; Package: 0402; Wattage: 1/16W; Tolerance: 5%; Footprint Ref: RES0402_0-5; Library Path: Y:\MIS_DATABASE\Library\ALTIUM_TOOL\SCHEMATICS_PARTS\MS_DISCRETE_Library.schlib
R276 = RESISTOR_Dup6: RES 220E 1/10W 5% 0402; Mistral Part No: 110009030506-R; Mfr_name: PANASONIC-ECG; Mfr_part_number: ERJ-2GEJ221X; Part_type: RESISTORS\FIXED; Project: RED EYE; Customs_HS_Code: 85332119; Custom_Duty: 15%; Voltage: NA; Footprint Ref: RES0402_0-5; Library Ref: RESISTOR; Tolerance: 5%; Wattage: 1/10W; Package: 0402; Distributor_name: DIGIKEY; Distributor_part_number: P220JCT-ND; Height: 0.40MM; Datasheet: Y:\MIS_DATABASE\DATASHEETS\RESISTORS\PAN-ERJSER_NOV17.PDF; Crtd /date: GEETHA/260406; Chkd/date: VASANTHA/291216; Weight: 0.8mg; Temperature: -55癈+155癈; MECHANICAL 3D STEP FILE: RES0402_0-5; Library Path: Y:\MIS_DATABASE\Library\ALTIUM_TOOL\SCHEMATICS_PARTS\MS_DISCRETE_Library.schlib; Footprint Path: Y:\MIS_DATABASE\Library\ALTIUM_TOOL\PCB_FOOTPRINTS\Altium_Footprint_Lib.PcbLib; PCB Footprint: RES0402_0-5
R277 = RESISTOR_Dup6: RES 51.1E 1/16W 1% 0402; Mistral Part No: 110017060001-R; Mfr_name: YAGEO AMERICA; Mfr_part_number: RC0402FR-0751R1L; Part_type: RESISTORS\FIXED; Project: TI_SVB_CONTROLLER CARD; Voltage: NA; Customs_HS_Code: 85332119; Custom_Duty: 15%; PCB Footprint: RES0402_0-5; Library Ref: RESISTOR; Tolerance: 1%; Wattage: 1/16W; Package: 0402; Distributor_name: DIGIKEY; Distributor_part_number: 311-51.1LRCT-ND; Height: 0.40MM; Weight: 0.65mg; Temperature: -55癈+155癈; Datasheet: Y:\MIS_DATABASE\DATASHEETS\RESISTORS\RCXXXXL-SER_MAR18.PDF; Crtd /date: MANIRAJA/280617; Chkd/date: MANIRAJA/280617; MECHANICAL 3D STEP FILE: RES0402_0-5; Footprint Ref: RES0402_0-5; Library Path: Y:\MIS_DATABASE\Library\ALTIUM_TOOL\SCHEMATICS_PARTS\MS_DISCRETE_Library.schlib; Footprint Path: Y:\MIS_DATABASE\Library\ALTIUM_TOOL\PCB_FOOTPRINTS\Altium_Footprint_Lib.PcbLib
R279 = RESISTOR_Dup6: RES 31.6K 1/10W 1% 0402; Mistral Part No: 110009030679-R; Mfr_name: PANASONIC-ECG; Mfr_part_number: ERJ-2RKF3162X; Part_type: RESISTORS\FIXED; Project: VOCERA; Customs_HS_Code: 85332119; Custom_Duty: 15%; Voltage: NA; Footprint Path: Y:\MIS_DATABASE\Library\ALTIUM_TOOL\PCB_FOOTPRINTS\Altium_Footprint_Lib.PcbLib; Library Path: Y:\MIS_DATABASE\Library\ALTIUM_TOOL\SCHEMATICS_PARTS\MS_DISCRETE_Library.schlib; Footprint Ref: RES0402_0-5; Library Ref: RESISTOR; Tolerance: 1%; Wattage: 1/10W; Package: 0402; Distributor_name: DIGIKEY; Distributor_part_number: P31.6KLCT-ND; Height: 0.40MM; Datasheet: Y:\MIS_DATABASE\DATASHEETS\RESISTORS\PAN-ERJSER_NOV17.PDF; Crtd /date: SHREESHAIL/070606; Chkd/date: SHREESHAIL/070606; PCB Footprint: RES0402_0-5; Weight: 0.8mg; Temperature: -55癈+155癈; MECHANICAL 3D STEP FILE: RES0402_0-5
R294 = RESISTOR_Dup6: RES 10K 1/16W 1% 0402; Part_type: RESISTORS\FIXED; Mfr_part_number: RC0402FR-0710KL; Mfr_name: YAGEO AMERICA; Mistral Part No: 110015090015-R; Custom_Duty: 15%; Customs_HS_Code: 85332119; Voltage: NA; Project: VOCERA; PCB Footprint: RES0402_0-5; Footprint Path: Y:\MIS_DATABASE\Library\ALTIUM_TOOL\PCB_FOOTPRINTS\Altium_Footprint_Lib.PcbLib; Library Path: Y:\MIS_DATABASE\Library\ALTIUM_TOOL\SCHEMATICS_PARTS\MS_DISCRETE_Library.schlib; Footprint Ref: RES0402_0-5; Library Ref: RESISTOR; MECHANICAL 3D STEP FILE: RES0402_0-5; Chkd/date: VASANTHA/201216; Crtd /date: GEETHA/290506; Datasheet: Y:\MIS_DATABASE\DATASHEETS\RESISTORS\RCXXXXL-SER_MAR18.PDF; Temperature: -55癈+155癈; Weight: 0.65mg; Height: 0.40MM; Distributor_part_number: 311-10.0KLRTR-ND; Distributor_name: DIGIKEY; Package: 0402; Wattage: 1/16W; Tolerance: 1%
R362 R407 = RESISTOR_Dup6: RES 220E 1/10W 5% 0402; Part_type: RESISTORS\FIXED; Mfr_part_number: ERJ-2GEJ221X; Mfr_name: PANASONIC-ECG; Mistral Part No: 110009030506-R; Voltage: NA; Custom_Duty: 15%; Customs_HS_Code: 85332119; Project: RED EYE; Footprint Path: Y:\MIS_DATABASE\Library\ALTIUM_TOOL\PCB_FOOTPRINTS\Altium_Footprint_Lib.PcbLib; Library Path: Y:\MIS_DATABASE\Library\ALTIUM_TOOL\SCHEMATICS_PARTS\MS_DISCRETE_Library.schlib; MECHANICAL 3D STEP FILE: RES0402_0-5; Temperature: -55癈+155癈; Weight: 0.8mg; Chkd/date: VASANTHA/291216; Crtd /date: GEETHA/260406; Datasheet: Y:\MIS_DATABASE\DATASHEETS\RESISTORS\PAN-ERJSER_NOV17.PDF; Height: 0.40MM; Distributor_part_number: P220JCT-ND; Distributor_name: DIGIKEY; Package: 0402; Wattage: 1/10W; Tolerance: 5%; Library Ref: RESISTOR; PCB Footprint: RES0402_0-5; Footprint Ref: RES0402_0-5
R412 R693 R694 R701 = RESISTOR_Dup5: RES 0E 1/16W JUMPER 0402; Mistral Part No: 110010080019-R; Mfr_name: VISHAY; Mfr_part_number: CRCW04020000Z0ED; Part_type: RESISTORS\FIXED; Project: PB_BUGBASE; Tolerance: NA; Customs_HS_Code: 85332119; Custom_Duty: 15%; PCB Footprint: RES0402_0-5; Footprint Path: Y:\MIS_DATABASE\Library\ALTIUM_TOOL\PCB_FOOTPRINTS\Altium_Footprint_Lib.PcbLib; Library Path: Y:\MIS_DATABASE\Library\ALTIUM_TOOL\SCHEMATICS_PARTS\MS_DISCRETE_Library.schlib; Footprint Ref: RES0402_0-5; Library Ref: RESISTOR; Voltage: NA; Wattage: 1/16W; Package: 0402; Distributor_name: DIGIKEY; Distributor_part_number: 541-0.0JCT-ND; Height: 0.40MM; Weight: 0.65mg; Temperature: -55癈+155癈; Datasheet: Y:\MIS_DATABASE\DATASHEETS\RESISTORS\CRCW0603.PDF; Crtd /date: MUDDU/190810; Chkd/date: VASANTHA/201216; MECHANICAL 3D STEP FILE: RES0402_0-5
R577-R579 R700 = RESISTOR_Dup5: RES 0E 1/16W JUMPER 0402; Part_type: RESISTORS\FIXED; Mfr_part_number: CRCW04020000Z0ED; Mfr_name: VISHAY; Mistral Part No: 110010080019-R; Custom_Duty: 15%; Customs_HS_Code: 85332119; Voltage: NA; Project: PB_BUGBASE; PCB Footprint: RES0402_0-5; MECHANICAL 3D STEP FILE: RES0402_0-5; Chkd/date: VASANTHA/201216; Crtd /date: MUDDU/190810; Datasheet: Y:\MIS_DATABASE\DATASHEETS\RESISTORS\CRCW0603.PDF; Temperature: -55癈+155癈; Weight: 0.65mg; Height: 0.40MM; Distributor_part_number: 541-0.0JCT-ND; Distributor_name: DIGIKEY; Package: 0402; Wattage: 1/16W; Tolerance: NA; Library Ref: RESISTOR; Footprint Ref: RES0402_0-5; Library Path: Y:\MIS_DATABASE\Library\ALTIUM_TOOL\SCHEMATICS_PARTS\MS_DISCRETE_Library.schlib; Footprint Path: Y:\MIS_DATABASE\Library\ALTIUM_TOOL\PCB_FOOTPRINTS\Altium_Footprint_Lib.PcbLib
R602 = RESISTOR_Dup6: RES 10K 1/16W 5% 0402; Mistral Part No: 110011060021-R; Mfr_name: YAGEO AMERICA; Mfr_part_number: RC0402JR-0710KL; Part_type: RESISTORS\FIXED; Project: HSE; Voltage: NA; Customs_HS_Code: 85332119; Custom_Duty: 15%; Footprint Path: Y:\MIS_DATABASE\Library\ALTIUM_TOOL\PCB_FOOTPRINTS\Altium_Footprint_Lib.PcbLib; Library Path: Y:\MIS_DATABASE\Library\ALTIUM_TOOL\SCHEMATICS_PARTS\MS_DISCRETE_Library.schlib; Footprint Ref: RES0402_0-5; Library Ref: RESISTOR; Tolerance: 5%; Wattage: 1/16W; Package: 0402; Distributor_name: DIGIKEY; Distributor_part_number: 311-10KJRCT-ND; Height: 0.40MM; Weight: 0.65mg; Temperature: -55癈+155癈; Datasheet: Y:\MIS_DATABASE\DATASHEETS\RESISTORS\RCXXXXL-SER_MAR18.PDF; Crtd /date: MAZHAR/230805; Chkd/date: VASANTHA/061216; MECHANICAL 3D STEP FILE: RES0402_0-5; PCB Footprint: RES0402_0-5
R695 = RESISTOR_Dup6: RES 2.2E 1/5W 5% 0603; Part_type: RESISTORS\FIXED; Mfr_part_number: ERJ-P03J2R2V; Mfr_name: PANASONIC-ECG; Mistral Part No: 110021040040-R; Custom_Duty: 15%; Customs_HS_Code: 85332119; Voltage: NA; Project: SP_EP2_RX BRD; Footprint Path: Y:\MIS_DATABASE\Library\ALTIUM_TOOL\PCB_FOOTPRINTS\Altium_Footprint_Lib.PcbLib; Library Path: Y:\MIS_DATABASE\Library\ALTIUM_TOOL\SCHEMATICS_PARTS\MS_DISCRETE_Library.schlib; MECHANICAL 3D STEP FILE: RES0603_0-75; Chkd/date: MANIRAJA/260421; Crtd /date: ALVY/260421; Datasheet: Y:\MIS_DATABASE\DATASHEETS\RESISTORS\ERJ-PA_P0-SER.PDF; Temperature: -55癈+155癈; Weight: 2mg; Height: 0.55MM; Footprint Ref: RES0603_0-75; Library Ref: RESISTOR; Distributor_part_number: P16036CT-ND; Distributor_name: DIGIKEY; Package: 0603; Wattage: 1/5W; Tolerance: 5%; PCB Footprint: RES0603_0-75
SW1 = SW3_B12JV: SWITCH TOGGLE SPDT RT TH; Part_type: ELECTRO-MECHANICAL\SWITCH; Mfr_name: NIDEC COPAL; Mistral Part No: 130017120017-R; Custom_Duty: 24%; Customs_HS_Code: 85369090; Wattage: NA; Project: TI_MAXIE_CPB; MECHANICAL 3D STEP FILE: SW3_ATE1F-6M3_370X710_TH_5-6; Chkd/date: MANIRAJA/291217; Crtd /date: MANIRAJA/291217; Datasheet: Y:\MIS_DATABASE\DATASHEETS\MISC\SWITCHES\ATE-SER.PDF; Temperature: -20癈+85癈; Weight: NA; Height: 5.60MM; Distributor_part_number: 563-1759-ND; Distributor_name: DIGIKEY; Package: THRU-HOLE; Voltage: NA; Tolerance: NA; Mfr_part_number: ATE1D-6M3-10-Z; Library Ref: SW3_B12JV; PCB Footprint: SW3_ATE1F-6M3_370X710_TH_5-6
TP12 = TESTPOINT: TESTPOINT 1.0MM DRILL PTH; Mfr_name: LOCAL; Mistral Part No: 130009030938; Project: HSE; PCB Footprint: TP_40X65; Library Ref: TESTPOINT; Chkd/date: MAZHAR/271211; Crtd /date: SHREESHAIL/041005; Datasheet: NA; Height: NA; Distributor_part_number: NA; Distributor_name: NA; Package: THRU-HOLE; Part_type: TESTPOINT; Mfr_part_number: TP_40X65
TP18 TP44 = TESTPOINT: TESTPOINT 1.0MM DRILL PTH; Mistral Part No: 130009030938; Mfr_name: LOCAL; Project: HSE; Mfr_part_number: TP_40X65; Part_type: TESTPOINT; Package: THRU-HOLE; Distributor_name: NA; Distributor_part_number: NA; Height: NA; Datasheet: NA; Crtd /date: SHREESHAIL/041005; Chkd/date: MAZHAR/271211; Library Ref: TESTPOINT; PCB Footprint: TP_40X65
U17 = TPS54334DRCT_VSON10: IC 3A O/P CURRENT SYNCHRONOUS STEP DOWN VOLTAGE CONVERTER VSON10; Part_type: ICS\POWER\CONVERTER; Mfr_name: TEXAS INSTRUMENTS; Mistral Part No: 142017090024-R; Custom_Duty: 15%; Customs_HS_Code: 85423100; Wattage: NA; Project: TI_MAXIE_CPB; Library Ref: TPS54334DRCT_VSON10; MECHANICAL 3D STEP FILE: SON10_19-68_125X125_1; Chkd/date: MANIRAJA/270917; Crtd /date: MANIRAJA/270917; Datasheet: Y:\MIS_DATABASE\DATASHEETS\ICS\POWER\TPS54334.PDF; Temperature: -40癈+85癈; Weight: 30mg; Height: 1.00MM; Distributor_part_number: 296-42172-2-ND; Distributor_name: DIGIKEY; Package: VSON10; Voltage: NA; Tolerance: NA; Mfr_part_number: TPS54334DRCT; PCB Footprint: SON10_19-68_125X125_1
U21 U22 U24 = MOSFET_CSD18501Q5A: IC MOSFET N-CHANNEL 60V VSONP8; Part_type: ICS\POWER\MOSFET; Mfr_name: TEXAS INSTRUMENTS; Mistral Part No: 142017100004-R; Custom_Duty: 15%; Customs_HS_Code: 85423100; Wattage: NA; Project: TI_MAXIE_CPB; MECHANICAL 3D STEP FILE: VSONP8_CSD18543Q_120X130_0-9; Chkd/date: MANIRAJA/041017; Crtd /date: MANIRAJA/041017; Datasheet: Y:\MIS_DATABASE\DATASHEETS\ICS\POWER\CSD18543Q3A.PDF; Temperature: -55癈+150癈; Weight: NA; Height: 0.90MM; Distributor_part_number: 296-47321-1-ND; Distributor_name: DIGIKEY; Package: VSONP8; Voltage: 60V; Tolerance: NA; Mfr_part_number: CSD18543Q3A; Library Ref: MOSFET_CSD18501Q5A; PCB Footprint: VSONP8_CSD18543Q_120X130_0-9; Footprint Ref: VSONP8_CSD18543Q_120X130_0-9; Library Path: Y:\MIS_DATABASE\Library\ALTIUM_TOOL\SCHEMATICS_PARTS\MS_MOSFET_Library.schlib; Footprint Path: Y:\MIS_DATABASE\Library\ALTIUM_TOOL\PCB_FOOTPRINTS\Altium_Footprint_Lib.PcbLib
U26 = MOSFET_CSD18501Q5A: IC MOSFET N-CHANNEL 60V VSONP8; Mistral Part No: 142017100004-R; Mfr_name: TEXAS INSTRUMENTS; Part_type: ICS\POWER\MOSFET; Project: TI_MAXIE_CPB; Tolerance: NA; Customs_HS_Code: 85423100; Custom_Duty: 15%; Mfr_part_number: CSD18543Q3A; Voltage: 60V; Wattage: NA; Package: VSONP8; Distributor_name: DIGIKEY; Distributor_part_number: 296-47321-1-ND; Height: 0.90MM; Weight: NA; Temperature: -55癈+150癈; Datasheet: Y:\MIS_DATABASE\DATASHEETS\ICS\POWER\CSD18543Q3A.PDF; Crtd /date: MANIRAJA/041017; Chkd/date: MANIRAJA/041017; MECHANICAL 3D STEP FILE: VSONP8_CSD18543Q_120X130_0-9; Library Ref: MOSFET_CSD18501Q5A; PCB Footprint: VSONP8_CSD18543Q_120X130_0-9; Footprint Ref: VSONP8_CSD18543Q_120X130_0-9; Library Path: Y:\MIS_DATABASE\Library\ALTIUM_TOOL\SCHEMATICS_PARTS\MS_MOSFET_Library.schlib; Footprint Path: Y:\MIS_DATABASE\Library\ALTIUM_TOOL\PCB_FOOTPRINTS\Altium_Footprint_Lib.PcbLib
U30 = LM5140QRWGTQ1_VQFNP40: IC WIDE I/P DUAL SYNCHRONOUS BUCK CONTROLLER VQFNP40; Part_type: ICS\POWER\CONVERTER; Mfr_name: TEXAS INSTRUMENTS; Mistral Part No: 142017100003-R; MECHANICAL 3D STEP FILE: QFN40_19-68_240X240_0-9_EP3-4; Custom_Duty: 15%; Customs_HS_Code: 85423100; Wattage: NA; Project: TI_MAXIE_CPB; Footprint Path: Y:\MIS_DATABASE\Library\ALTIUM_TOOL\PCB_FOOTPRINTS\Altium_Footprint_Lib.PcbLib; Library Path: Y:\MIS_DATABASE\Library\ALTIUM_TOOL\SCHEMATICS_PARTS\MS_MISCPOWER_Library.schlib; Footprint Ref: QFN40_19-68_240X240_0-9_EP3-4; Library Ref: LM5140QRWGTQ1_VQFNP40; Chkd/date: MANIRAJA/041017; Crtd /date: MANIRAJA/041017; Datasheet: Y:\MIS_DATABASE\DATASHEETS\ICS\POWER\LM5140QRWGXX.PDF; Temperature: -40癈+150癈; Weight: 104mg; Height: 0.90MM; Distributor_part_number: 296-43790-1-ND; Distributor_name: DIGIKEY; Package: VQFNP40; Voltage: NA; Tolerance: NA; Mfr_part_number: LM5140QRWGTQ1; PCB Footprint: QFN40_19-68_240X240_0-9_EP3-4
U102 = SN74LVC1G32DBVR_SOT23-5: IC SINGAL 2 INPUT POSITIVE OR GATE SOT23-5; Mistral Part No: 141009030236-R; Mfr_name: TEXAS INSTRUMENTS; Part_type: ICS\DIGITAL\GATES; Project: SVDO_RMB_MMA; Tolerance: NA; Customs_HS_Code: 85423100; Custom_Duty: 15%; PCB Footprint: SOT23-5_1-5; Mfr_part_number: SN74LVC1G32DBVR; Voltage: NA; Wattage: NA; Package: SOT23-5; Distributor_name: DIGIKEY; Distributor_part_number: 296-9847-1-ND; Height: 1.45MM; Weight: 6.3mg; Temperature: -40癈+85癈; Datasheet: Y:\MIS_DATABASE\DATASHEETS\ICS\DIGITAL\GATES\SN74LVC1G32.PDF; Crtd /date: MAZHAR/070806; Chkd/date: MANIRAJA/051017; MECHANICAL 3D STEP FILE: SOT23-5_1-5